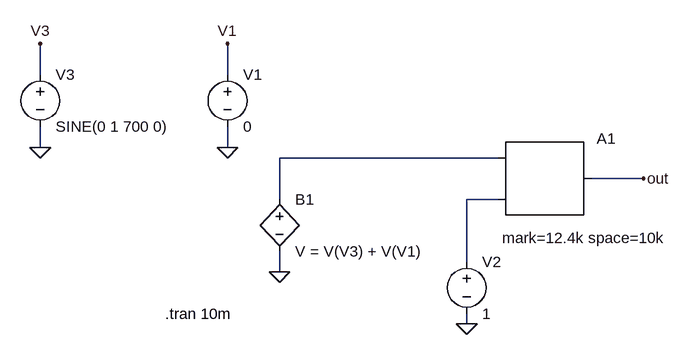
[diagram p0: schematic FM_mod.asc]
FM_mod.asc, the LTspice schematic file:
Version 4
SHEET 1 880 680
WIRE -608 0 -608 -48
WIRE -320 0 -320 -48
WIRE -608 112 -608 80
WIRE -320 112 -320 80
WIRE 96 128 -240 128
WIRE 320 160 240 160
WIRE -240 192 -240 128
WIRE 96 192 48 192
WIRE 48 288 48 192
WIRE -240 304 -240 272
WIRE 48 384 48 368
FLAG -320 112 0
FLAG 320 160 out
FLAG 48 384 0
FLAG -608 112 0
FLAG -608 -48 V3
FLAG -320 -48 V1
FLAG -240 304 0
SYMBOL SpecialFunctions\\modulate 96 128 R0
WINDOW 3 7 123 Left 2
SYMATTR Value mark=12.4k space=10k
SYMATTR InstName A1
SYMBOL voltage -320 -16 R0
WINDOW 123 0 0 Left 2
WINDOW 39 0 0 Left 2
SYMATTR InstName V1
SYMATTR Value 0
SYMBOL voltage 48 272 R0
WINDOW 123 0 0 Left 2
WINDOW 39 0 0 Left 2
SYMATTR InstName V2
SYMATTR Value 1
SYMBOL voltage -608 -16 R0
WINDOW 123 0 0 Left 2
WINDOW 39 0 0 Left 2
SYMATTR InstName V3
SYMATTR Value SINE(0 1 700 0)
SYMBOL bv -240 176 R0
SYMATTR InstName B1
SYMATTR Value V = V(V3) + V(V1)
TEXT -416 368 Left 2 !.tran 10m

The netlist it stands for:
* FM_mod.asc
A1 N001 N002 0 0 0 0 out 0 MODULATOR mark=12.4k space=10k
V1 V1 0 0
V2 N002 0 1
V3 V3 0 SINE(0 1 700 0)
B1 N001 0 V = V(V3) + V(V1)
.tran 10m
.backanno
.end

* Results of the author's LTspice run, read from the files saved beside the schematic
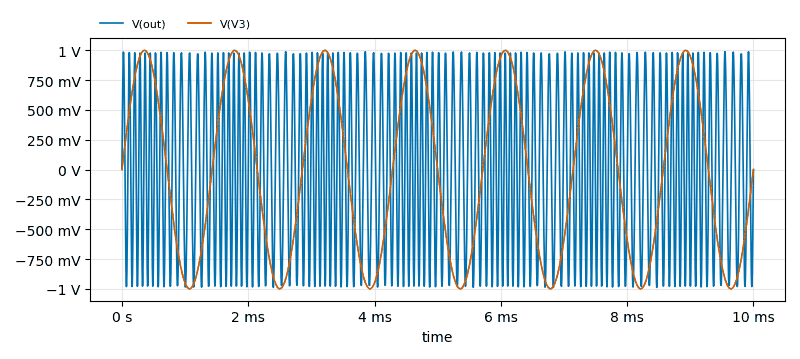
[diagram p1: Transient Analysis of FM_mod.asc, plotted from the saved traces]
* Transient Analysis, 1 run:
*   V(out): min -987.9 mV, max 989.1 mV, average 38.86 µV, rms 695.8 mV, last -5.566 mV
*   V(V3): min -999.8 mV, max 1 V, average 53.53 µV, rms 706.9 mV, last 0 V